# Altium project Node.PrjPCB
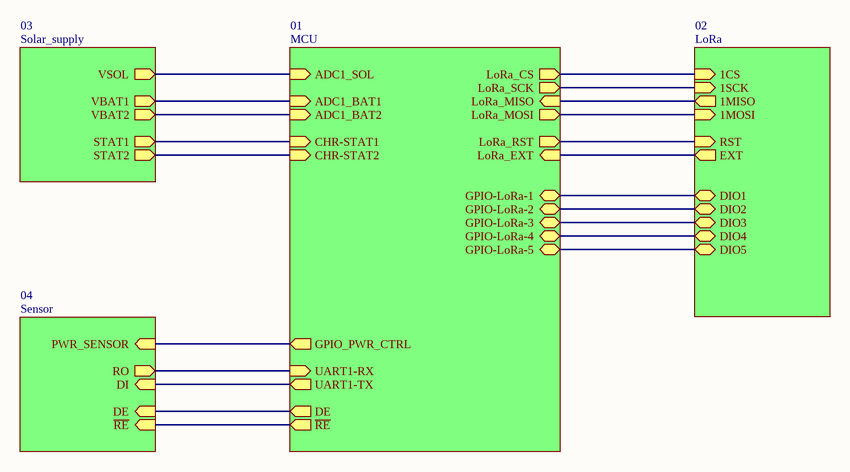
[diagram p0: Main.SchDoc]
5 sheets, 112 parts. Net scope: hierarchical (ports join the sheet entries above them; power ports are global).
Board files: Node.PcbDoc, Node_v2.PcbDoc
Sheets:
  Main.SchDoc
    03 = Solar_supply.SchDoc
    01 = MCU.SchDoc
    02 = LoRa.SchDoc
    04 = Sensor.SchDoc

## Sheet Main.SchDoc: =ProjectName
size A4; CheckedBy: DatNB; Author: Ven; CompanyName: Nacentech; Organization: IMET

### Sub-sheets
01 = MCU: LoRa_MOSI (out), LoRa_MISO (in), ADC1_SOL (in), GPIO-LoRa-3 (bidir), GPIO-LoRa-4 (bidir), CHR-STAT2 (in), CHR-STAT1 (in), DE (out), UART1-TX (out), GPIO-LoRa-1 (bidir), GPIO-LoRa-2 (bidir), ADC1_BAT2 (in), ADC1_BAT1 (in), LoRa_RST (out), LoRa_CS (out), LoRa_EXT (in), GPIO-LoRa-5 (bidir), UART1-RX (in), LoRa_SCK (out), GPIO_PWR_CTRL (out), ~{RE} (out)
02 = LoRa: 1CS (in), 1MOSI (in), EXT (out), 1MISO (out), 1SCK (in), RST (in), DIO4 (bidir), DIO5 (bidir), DIO1 (bidir), DIO3 (bidir), DIO2 (bidir)
03 = Solar_supply: VBAT2 (out), STAT1 (out), VBAT1 (out), VSOL (out), STAT2 (out)
04 = Sensor: ~{RE} (in), RO (out), DI (in), DE (in), PWR_SENSOR (in)

### Nets
NetC5_1: sheet 03/VBAT1, sheet 01/ADC1_BAT1
NetC6_1: sheet 03/VBAT2, sheet 01/ADC1_BAT2
NetC7_1: sheet 03/VSOL, sheet 01/ADC1_SOL
NetIC2_1: sheet 01/UART1-RX, sheet 04/RO
NetIC2_2: sheet 01/~{RE}, sheet 04/~{RE}
NetIC2_3: sheet 01/DE, sheet 04/DE
NetIC2_4: sheet 01/UART1-TX, sheet 04/DI
NetIC4_3: sheet 03/STAT1, sheet 01/CHR-STAT1
NetIC4_5: sheet 03/STAT2, sheet 01/CHR-STAT2
NetR3_1: sheet 01/LoRa_EXT, sheet 02/EXT
NetR12_2: sheet 01/GPIO_PWR_CTRL, sheet 04/PWR_SENSOR
NetU1_4: sheet 01/LoRa_RST, sheet 02/RST
NetU1_6: sheet 01/GPIO-LoRa-1, sheet 02/DIO1
NetU1_7: sheet 01/GPIO-LoRa-2, sheet 02/DIO2
NetU1_8: sheet 01/GPIO-LoRa-3, sheet 02/DIO3
NetU1_10: sheet 01/GPIO-LoRa-4, sheet 02/DIO4
NetU1_11: sheet 01/GPIO-LoRa-5, sheet 02/DIO5
NetU1_12: sheet 01/LoRa_SCK, sheet 02/1SCK
NetU1_13: sheet 01/LoRa_MISO, sheet 02/1MISO
NetU1_14: sheet 01/LoRa_MOSI, sheet 02/1MOSI
NetU1_15: sheet 01/LoRa_CS, sheet 02/1CS

### Notes on the sheet
- Project:
- Page Contents:
- Size:
- Date:
- A4
- Checked by:
- Time:
- Revision:
- Sheet
- of
- File:

## Sheet Solar_supply.SchDoc: =ProjectName
size A4; CheckedBy: DatNB; Author: Ven; CompanyName: Nacentech; Organization: IMET
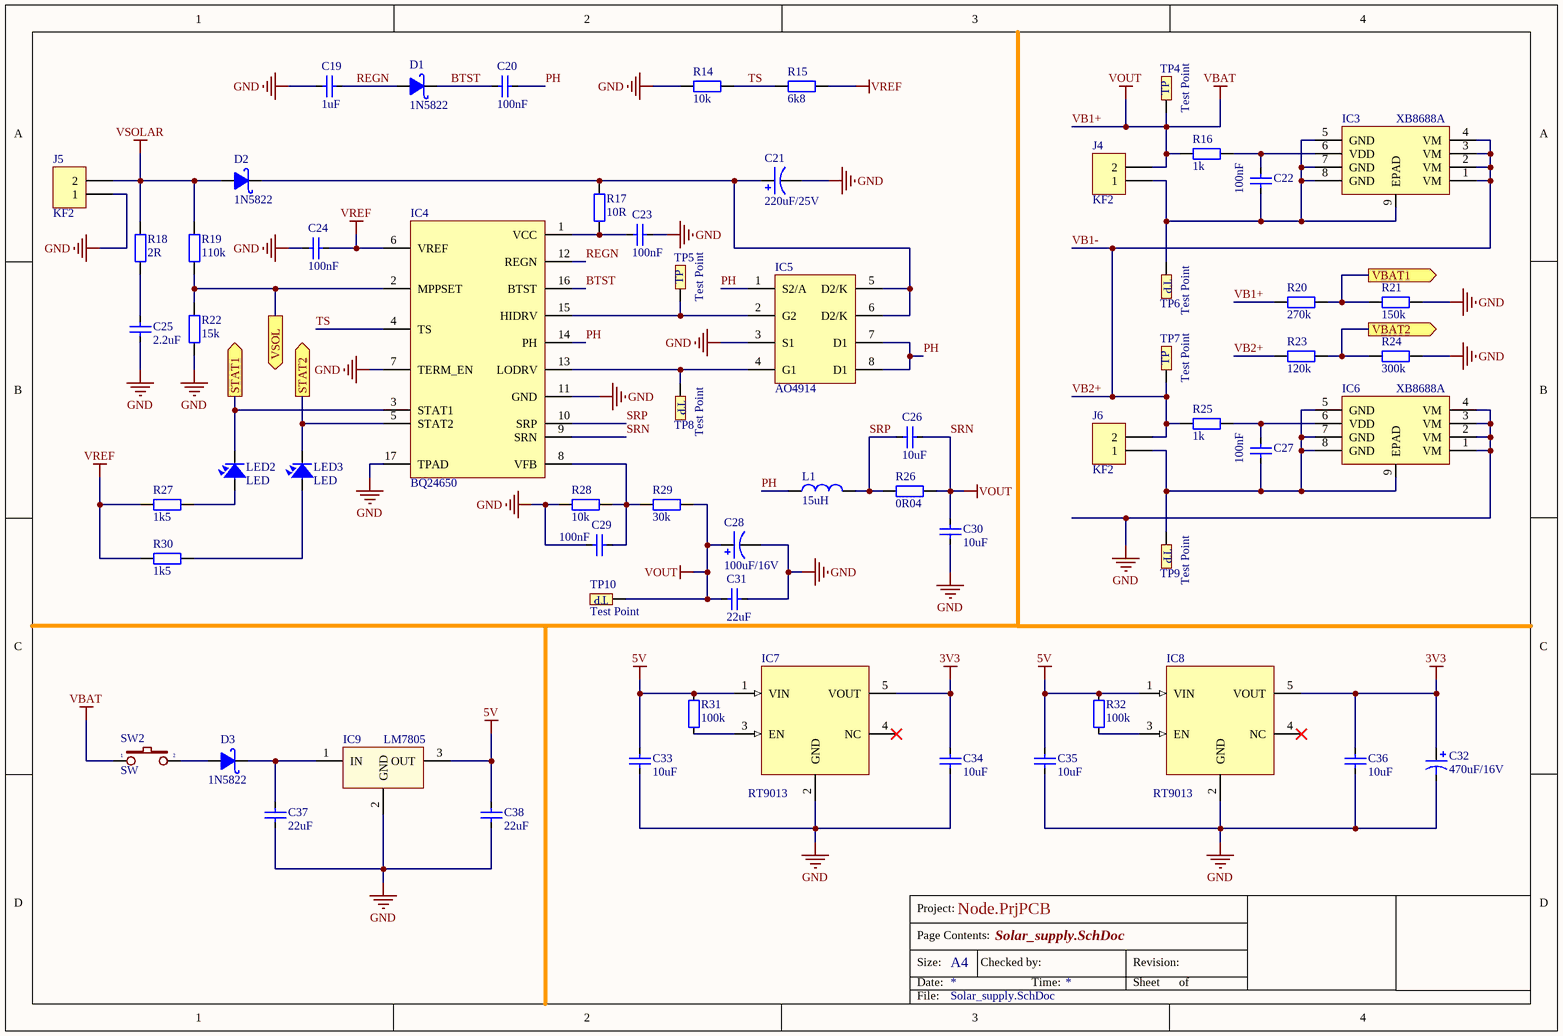
[diagram p1: Solar_supply.SchDoc]

### Parts
C19  1uF  [CAP_0805]
C20  100nF  [CAP_0805]
C21  220uF/25V  [C5mm]
C22  100nF  [CAP_0805]
C23  100nF  [CAP_0805]
C24  100nF  [CAP_0805]
C25  2.2uF  [CAP_0805]
C26  10uF  [CAP_0805]
C27  100nF  [CAP_0805]
C28  100uF/16V  [C5mm]
C29  100nF  [CAP_0805]
C30  10uF  [CAP_0805]
C31  22uF  [CAP_0805]
C32  470uF/16V  [C8mm]
C33  10uF  [CAP_0805]
C34  10uF  [CAP_0805]
C35  10uF  [CAP_0805]
C36  10uF  [CAP_0805]
C37  22uF  [CAP_0805]
C38  22uF  [CAP_0805]
D1  1N5822  [DIO-214AC(SMA)]
D2  1N5822  [DIO-214AC(SMA)]
D3  1N5822  [DIO-214AC(SMA)]
IC3  XB8688A  [SOP8-PP]
IC4  BQ24650  [VQFN-16]
IC5  AO4914  [SOIC-8]
IC6  XB8688A  [SOP8-PP]
IC7  RT9013  [SOT23-5]
IC8  RT9013  [SOT23-5]
IC9  LM7805  [TO-252]
J4  KF2  [KF2-5.08]
J5  KF2  [KF2-5.08]
J6  KF2  [KF2-5.08]
L1  15uH  [L-SMD-M-7.3x4.5]
LED2  LED  [LED-0805-Red]
LED3  LED  [LED-0805-Orange]
R14  10k  [RES-SMD-0805]
R15  6k8  [RES-SMD-0805]
R16  1k  [RES-SMD-0805]
R17  10R  [RES-SMD-0805]
R18  2R  [RES-SMD-0805]
R19  110k  [RES-SMD-0805]
R20  270k  [RES-SMD-0805]
R21  150k  [RES-SMD-0805]
R22  15k  [RES-SMD-0805]
R23  120k  [RES-SMD-0805]
R24  300k  [RES-SMD-0805]
R25  1k  [RES-SMD-0805]
R26  0R04  [RES-SMD-2512]
R27  1k5  [RES-SMD-0805]
R28  10k  [RES-SMD-0805]
R29  30k  [RES-SMD-0805]
R30  1k5  [RES-SMD-0805]
R31  100k  [RES-SMD-0805]
R32  100k  [RES-SMD-0805]
SW2  SW  [SW2]
TP4  Test Point  [TP_SMD]
TP5  Test Point  [TP_SMD]
TP6  Test Point  [TP_SMD]
TP7  Test Point  [TP_SMD]
TP8  Test Point  [TP_SMD]
TP9  Test Point  [TP_SMD]
TP10  Test Point  [TP_SMD]

### Ports
STAT1 (out), STAT2 (out), VBAT1 (out), VBAT2 (out), VSOL (out)

### Nets
3V3: C32.1 C34.2 C36.2 IC7.5(VOUT) IC8.5(VOUT)
5V: C33.2 C35.2 C38.2 IC7.1(VIN) IC8.1(VIN) IC9.3(OUT) R31.1 R32.1
GND: C19.2 C21.2 C23.2 C24.2 C25.1 C28.2 C29.1 C30.1 C31.1 C32.2 C33.1 C34.1 C35.1 C36.1 C37.1 C38.1 IC4.7(TERM_EN) IC4.11(GND) IC4.17(TPAD) IC5.3(S1) IC6.1(VM) IC6.2(VM) IC6.3(VM) IC6.4(VM) IC7.2(GND) IC8.2(GND) IC9.2(GND) J5.1 R14.1 R21.1 R22.2 R24.1 R28.1
SRN: C26.1 C28.1 C30.2 C31.2 IC4.9(SRN) J4.2 R16.2 R20.2 R26.2 R29.1 SW2.1 TP4.1 TP10.1  [also labelled VB1+, VBAT, VOUT]
VREF: C24.1 IC4.6(VREF) R15.2 R27.1 R30.1
VSOLAR: D2.1(A) J5.2 R18.1 R19.2
BTST: C20.1 D1.2(K) IC4.16(BTST)
PH: C20.2 IC4.14(PH) IC5.1(S2/A) IC5.7(D1) IC5.8(D1) L1.1
REGN: C19.1 D1.1(A) IC4.12(REGN)
SRP: C26.2 IC4.10(SRP) L1.2 R26.1
TS: IC4.4(TS) R14.2 R15.1
VB1-: IC3.1(VM) IC3.2(VM) IC3.3(VM) IC3.4(VM) J6.2 R23.2 R25.2 TP7.1  [also labelled VB2+]
NetC5_1: R20.1 R21.2 ; port VBAT1
NetC6_1: R23.1 R24.2 ; port VBAT2
NetC7_1: IC4.2(MPPSET) R19.1 R22.1 ; port VSOL
NetC21_1: C21.1 D2.2(K) IC5.5(D2/K) IC5.6(D2/K) R17.1
NetC22_1: C22.1 IC3.5(GND) IC3.7(GND) IC3.8(GND) IC3.9(EPAD) J4.1 TP6.1
NetC22_2: C22.2 IC3.6(VDD) R16.1
NetC23_1: C23.1 IC4.1(VCC) R17.2
NetC25_2: C25.2 R18.2
NetC27_1: C27.1 IC6.5(GND) IC6.7(GND) IC6.8(GND) IC6.9(EPAD) J6.1 TP9.1
NetC27_2: C27.2 IC6.6(VDD) R25.1
NetC29_2: C29.2 IC4.8(VFB) R28.2 R29.2
NetC37_2: C37.2 D3.2(K) IC9.1(IN)
NetD3_1: D3.1(A) SW2.2
NetIC4_3: IC4.3(STAT1) LED2.2 ; port STAT1
NetIC4_5: IC4.5(STAT2) LED3.2 ; port STAT2
NetIC4_13: IC4.13(LODRV) IC5.4(G1) TP8.1
NetIC4_15: IC4.15(HIDRV) IC5.2(G2) TP5.1
NetIC7_3: IC7.3(EN) R31.2
NetIC8_3: IC8.3(EN) R32.2
NetLED2_1: LED2.1 R27.2
NetLED3_1: LED3.1 R30.2

Not connected (* = marked no-connect by the designer): IC7 4(NC)*; IC8 4(NC)*

### Notes on the sheet
- Project:
- Page Contents:
- Size:
- Date:
- A4
- Checked by:
- Time:
- Revision:
- Sheet
- of
- File:

### Library data of the parts
C19 C20 C22-C27 C29-C31 C33-C38 = CapSMD: Capacitor; Value: 33p; Published: 8-Jun-2000; LatestRevisionDate: 17-Jul-2002; LatestRevisionNote: Re-released for DXP Platform.; PackageReference: RAD-0.3; Publisher: Altium Limited
C21 C28 C32 = Cap Pol: Polarized Capacitor (Axial); Published: 8-Jun-2000; LatestRevisionDate: 17-Jul-2002; LatestRevisionNote: Re-released for DXP Platform.; PackageReference: POLAR0.8; Publisher: Altium Limited
D1-D3 = 1N5822: Schottky Rectifiers; Value: Diode c?m 1N5408
IC3 IC6 = XB8688: One Cell Lithium-ion/Polymer Battery Protection IC
IC4 = BQ24650: BQ24650 Stand-Alone Synchronous Buck Battery Charge Controller for Solar Power / With Maximum Power Point Tracking
IC5 = AO4914: Dual N-Channel Enhancement Mode Field Effect Transistor with Schottky Diode
IC7 IC8 = RT9013: RT9013-33GB IC REG LINEAR 3.3V 500mA SOT23-5
IC9 = LM78xx: LDO to 5V; Value: LM7805
J4-J6 = KF2: Manufacturer: Würth Elektronik eiSos GmbH; partNo: 691103110002; ComponentLink1 Description: Manufacturer; ComponentLink2 Description: Datasheet; NoPins: 2; Created Date: 29 October 2013; ComponentLink1URL: http://www.we-online.com; ComponentLink2URL: http://katalog.we-online.de/em/datasheet/6911031100xx.pdf; Created by: Karrer Zheng
L1 = Inductor: Value: 150 mH
LED2 LED3 = LED: LED Single colour Green and Red; Value: LED 3 ly Single Colour
R14-R30 = Resistor - SMD: Resistor SMD; Manufacturer: Generic Components; Class: Passive; Published: 08/06/2000; Publisher: Altium Hobart Technology Centre
R31 R32 = Resistor - SMD: Resistor; Manufacturer: Generic Components; Class: Passive; Published: 08/06/2000; Publisher: Altium Hobart Technology Centre
SW2 = SW2: Switch button 2 pin; Value: SW chip 2 pin
TP4-TP10 = TP: CONNECT 1

## Sheet MCU.SchDoc: =ProjectName
size A4; CheckedBy: DatNB; Author: Ven; CompanyName: Nacentech; Organization: IMET
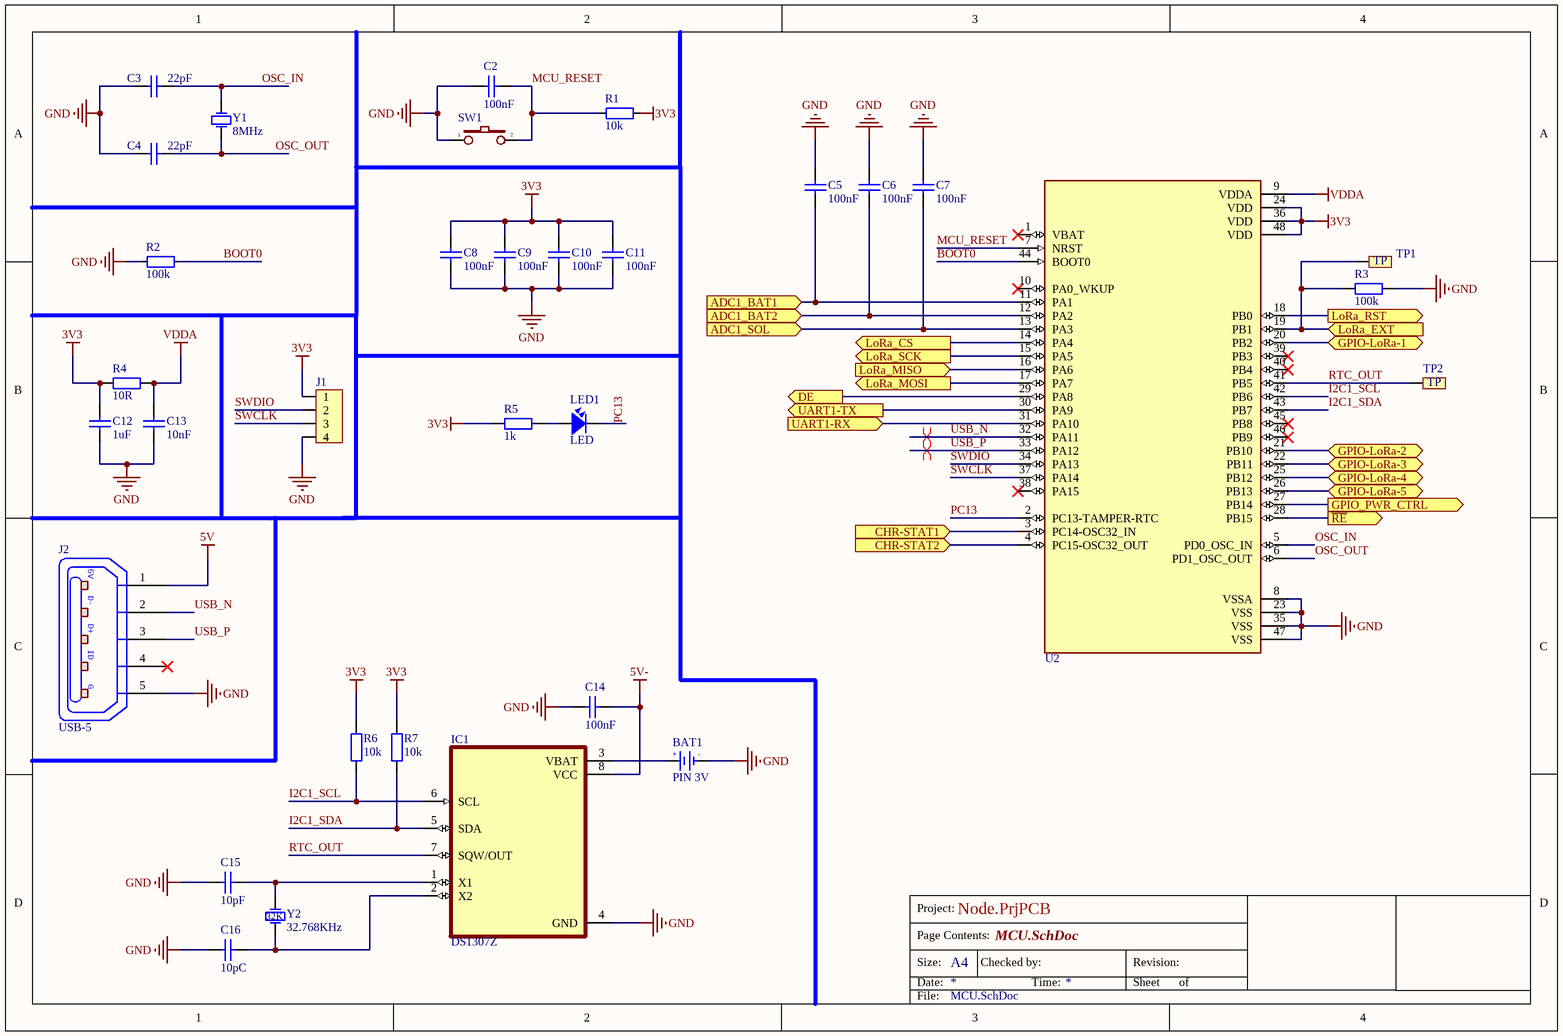
[diagram p2: MCU.SchDoc]

### Parts
BAT1  PIN 3V  [CR1220 SMD]
C2  100nF  [CAP_0805]
C3  22pF  [CAP_0805]
C4  22pF  [CAP_0805]
C5  100nF  [CAP_0805]
C6  100nF  [CAP_0805]
C7  100nF  [CAP_0805]
C8  100nF  [CAP_0805]
C9  100nF  [CAP_0805]
C10  100nF  [CAP_0805]
C11  100nF  [CAP_0805]
C12  1uF  [CAP_0805]
C13  10nF  [CAP_0805]
C14  100nF  [CAP_0805]
C15  10pF  [CAP_0805]
C16  10pC  [CAP_0805]
IC1  DS1307Z  [SOIC-8]
J1  ST_Link  [Jump_4p]  (value not drawn)
J2  USB-5  [USB-M1]
LED1  LED  [LED-0805-Red]
R1  10k  [RES-SMD-0805]
R2  100k  [RES-SMD-0805]
R3  100k  [RES-SMD-0805]
R4  10R  [RES-SMD-0805]
R5  1k  [RES-SMD-0805]
R6  10k  [RES-SMD-0805]
R7  10k  [RES-SMD-0805]
SW1  SW  [SW 3x2x4]  (value not drawn)
TP1  Test Point  [TP_SMD]  (value not drawn)
TP2  Test Point  [TP_SMD]  (value not drawn)
U2  STM32  [LQFP 48]  (value not drawn)
Y1  8MHz  [XTAL]
Y2  32.768KHz  [XTAL32K]

### Ports
ADC1_BAT1 (in), ADC1_BAT2 (in), ADC1_SOL (in), CHR-STAT1 (in), CHR-STAT2 (in), DE (out), GPIO-LoRa-1 (bidir), GPIO-LoRa-2 (bidir), GPIO-LoRa-3 (bidir), GPIO-LoRa-4 (bidir), GPIO-LoRa-5 (bidir), GPIO_PWR_CTRL (out), LoRa_CS (out), LoRa_EXT (in), LoRa_MISO (in), LoRa_MOSI (out), LoRa_RST (out), LoRa_SCK (out), UART1-RX (in), UART1-TX (out), ~{RE} (out)

### Nets
3V3: C8.2 C9.2 C10.2 C11.2 C12.2 J1.1 R1.1 R4.1 R5.1 R6.2 R7.2 U2.24(VDD) U2.36(VDD) U2.48(VDD)
5V: J2.1(P1)
5V-: C14.2 IC1.8(VCC)
GND: BAT1.2(GND) C2.1 C3.1 C4.1 C5.2 C6.2 C7.2 C8.1 C9.1 C10.1 C11.1 C12.1 C13.1 C14.1 C15.2 C16.2 IC1.4(GND) J1.4 J2.5(P5) R2.2 R3.2 SW1.1 U2.8(VSSA) U2.23(VSS) U2.35(VSS) U2.47(VSS)
VDDA: C13.2 R4.2 U2.9(VDDA)
BOOT0: R2.1 U2.44(BOOT0)
I2C1_SCL: IC1.6(SCL) R6.1 U2.42(PB6)
I2C1_SDA: IC1.5(SDA) R7.1 U2.43(PB7)
MCU_RESET: C2.2 R1.2 SW1.2 U2.7(NRST)
OSC_IN: C3.2 U2.5(PD0_OSC_IN) Y1.1(OSC1)
OSC_OUT: C4.2 U2.6(PD1_OSC_OUT) Y1.2(OSC2)
PC13: LED1.2 U2.2(PC13-TAMPER-RTC)
RTC_OUT: IC1.7(SQW/OUT) TP2.1 U2.41(PB5)
SWCLK: J1.3 U2.37(PA14)
SWDIO: J1.2 U2.34(PA13)
USB_N: J2.2(P2) U2.32(PA11)
USB_P: J2.3(P3) U2.33(PA12)
NetBAT1_1: BAT1.1(+3V) IC1.3(VBAT)
NetC5_1: C5.1 U2.11(PA1) ; port ADC1_BAT1
NetC6_1: C6.1 U2.12(PA2) ; port ADC1_BAT2
NetC7_1: C7.1 U2.13(PA3) ; port ADC1_SOL
NetC15_1: C15.1 IC1.1(X1) Y2.1(OSC1)
NetC16_1: C16.1 IC1.2(X2) Y2.2(OSC2)
NetIC2_1: U2.31(PA10) ; port UART1-RX
NetIC2_2: U2.28(PB15) ; port ~{RE}
NetIC2_3: U2.29(PA8) ; port DE
NetIC2_4: U2.30(PA9) ; port UART1-TX
NetIC4_3: U2.3(PC14-OSC32_IN) ; port CHR-STAT1
NetIC4_5: U2.4(PC15-OSC32_OUT) ; port CHR-STAT2
NetLED1_1: LED1.1 R5.2
NetR3_1: R3.1 TP1.1 U2.19(PB1) ; port LoRa_EXT
NetR12_2: U2.27(PB14) ; port GPIO_PWR_CTRL
NetU1_4: U2.18(PB0) ; port LoRa_RST
NetU1_6: U2.20(PB2) ; port GPIO-LoRa-1
NetU1_7: U2.21(PB10) ; port GPIO-LoRa-2
NetU1_8: U2.22(PB11) ; port GPIO-LoRa-3
NetU1_10: U2.25(PB12) ; port GPIO-LoRa-4
NetU1_11: U2.26(PB13) ; port GPIO-LoRa-5
NetU1_12: U2.15(PA5) ; port LoRa_SCK
NetU1_13: U2.16(PA6) ; port LoRa_MISO
NetU1_14: U2.17(PA7) ; port LoRa_MOSI
NetU1_15: U2.14(PA4) ; port LoRa_CS

Not connected (* = marked no-connect by the designer): J2 4(P4)*; U2 1(VBAT)* 10(PA0_WKUP)* 38(PA15)* 39(PB3)* 40(PB4)* 45(PB8)* 46(PB9)*

### Layout directives
differential pair: USB_N, USB_P

### Notes on the sheet
- Project:
- Page Contents:
- Size:
- Date:
- A4
- Checked by:
- Time:
- Revision:
- Sheet
- of
- File:
- (in symbol PIN 3V) +; -
- (in symbol USB-5) 5V; D-; D+; ID; G
- (in symbol XTAL/32KHz) 32K

### Library data of the parts
BAT1 = PIN 3V: Battery 3VDC; Value: PIN 3V
C2-C16 = CapSMD: Capacitor; Value: 33p; Published: 8-Jun-2000; LatestRevisionDate: 17-Jul-2002; LatestRevisionNote: Re-released for DXP Platform.; PackageReference: RAD-0.3; Publisher: Altium Limited
J1 = Header4: Header IDC, 4 x 1 Pin Vertical 2.54mm Pitch (Non-Boxed, Male); Manufacturer: W¨¹rth Elektronik eiSos GmbH; partNo: 613002143121; ComponentLink1 Description: Manufacturer; ComponentLink2 Description: Datasheet; NoPins: 02; Created Date: 29 March 2013; ComponentLink1URL: http://www.we-online.com; ComponentLink2URL: http://katalog.we-online.de/em/datasheet/6130xx143121.pdf; Created by: Karrer Zheng
J2 = USB-5: Manufacturer: FCI; Manufacturer Part Number: 10118193-0001LF; Connector Type: USB - micro B; Number of Contacts: 5; Gender: Receptacle; Specifications: USB 2.0; .Creator: MM; .Checked PCB: RF; Supplier 1: Digi-Key; RoHS: RoHS Compliant; Category: Connectors, Interconnects; Stock 1: 28642; Pricing 1: 1=0.46, 10=0.433, 25=0.3712, 50=0.3156, 100=0.3032, 250=0.27224, 500=0.25988 (USD); Packaging: Cut Tape (CT); Mounting Type: Surface Mount, Right Angle, Horizontal; Features: Shielded, Solder Retention; Ingress Protection: -; ComponentLink1URL: http://portal.fciconnect.com/Comergent//fci/drawing/10118193.pdf; ComponentLink1Description: http://portal.fciconnect.com/Comergent//fci/drawing/10118193.pdf; Supplier Part Number 1: 609-4616-1-ND; .Checked SCH: MM
LED1 = LED: as LED2 on sheet Solar_supply
R1 R2 = Resistor - SMD: as R31 on sheet Solar_supply; Published: 08/06/2000; Publisher: Altium Hobart Technology Centre
R3-R7 = Resistor - SMD: as R14 on sheet Solar_supply; Published: 08/06/2000; Publisher: Altium Hobart Technology Centre
SW1 = SW2: as SW2 on sheet Solar_supply
TP1 TP2 = TP: CONNECT 1
U2 = STM32F103C8T6: STM32 ARM-based 32-bit MCU with 64 Kbytes Flash, 64-pin LQFP, Industrial Temperature
Y1 = XTAL: Crystal Oscillator; Published: 8-Jun-2000; LatestRevisionDate: 17-Jul-2002; LatestRevisionNote: Re-released for DXP Platform.; PackageReference: R38; Publisher: Altium Limited
Y2 = XTAL/32KHz: Crystal Oscillator; Published: 8-Jun-2000; LatestRevisionDate: 17-Jul-2002; LatestRevisionNote: Re-released for DXP Platform.; PackageReference: R38; Publisher: Altium Limited

## Sheet LoRa.SchDoc: =ProjectName
size A4; CheckedBy: DatNB; Author: Ven; CompanyName: Nacentech; Organization: IMET
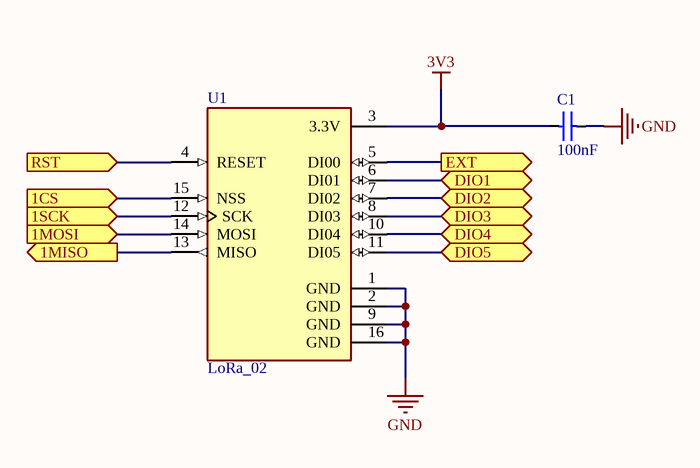
[diagram p3: LoRa.SchDoc]

### Parts
C1  100nF  [CAP_0805]
U1  LoRa_02  [Ra-02]

### Ports
1CS (in), 1MISO (out), 1MOSI (in), 1SCK (in), DIO1 (bidir), DIO2 (bidir), DIO3 (bidir), DIO4 (bidir), DIO5 (bidir), EXT (out), RST (in)

### Nets
3V3: C1.1 U1.3(3.3V)
GND: C1.2 U1.1(GND) U1.2(GND) U1.9(GND) U1.16(GND)
NetR3_1: U1.5(DI00) ; port EXT
NetU1_4: U1.4(RESET) ; port RST
NetU1_6: U1.6(DI01) ; port DIO1
NetU1_7: U1.7(DI02) ; port DIO2
NetU1_8: U1.8(DI03) ; port DIO3
NetU1_10: U1.10(DI04) ; port DIO4
NetU1_11: U1.11(DI05) ; port DIO5
NetU1_12: U1.12(SCK) ; port 1SCK
NetU1_13: U1.13(MISO) ; port 1MISO
NetU1_14: U1.14(MOSI) ; port 1MOSI
NetU1_15: U1.15(NSS) ; port 1CS

### Notes on the sheet
- Project:
- Page Contents:
- Size:
- Date:
- A4
- Checked by:
- Time:
- Revision:
- Sheet
- of
- File:

### Library data of the parts
C1 = CapSMD: Capacitor; Value: 33p; Published: 8-Jun-2000; LatestRevisionDate: 17-Jul-2002; LatestRevisionNote: Re-released for DXP Platform.; PackageReference: RAD-0.3; Publisher: Altium Limited

## Sheet Sensor.SchDoc: =ProjectName
size A4; CheckedBy: DatNB; Author: Ven; CompanyName: Nacentech; Organization: IMET
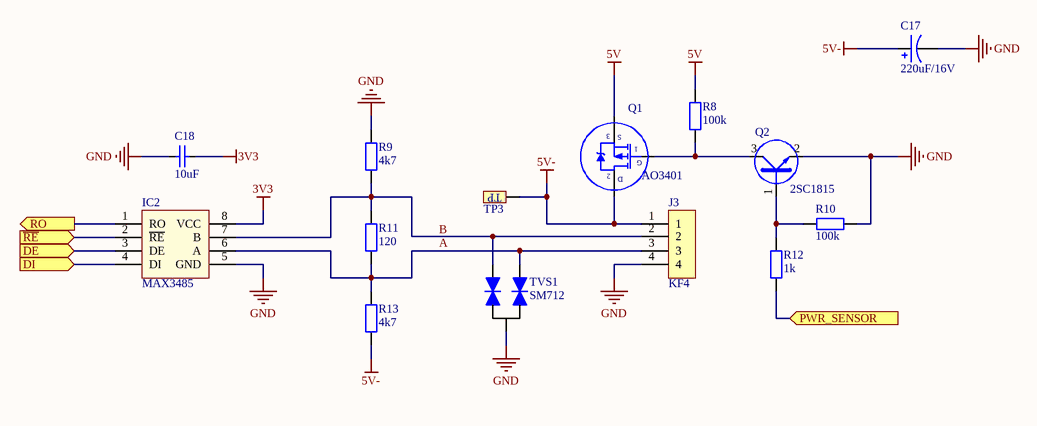
[diagram p4: Sensor.SchDoc]

### Parts
C17  220uF/16V  [C5mm]
C18  10uF  [CAP_0805]
IC2  MAX3485  [SO-8]
J3  KF4  [KF4-5.08]
Q1  AO3401  [SOT23A]
Q2  2SC1815  [SOT23D]
R8  100k  [RES-SMD-0805]
R9  4k7  [RES-SMD-0805]
R10  100k  [RES-SMD-0805]
R11  120  [RES-SMD-0805]
R12  1k  [RES-SMD-0805]
R13  4k7  [RES-SMD-0805]
TP3  Test Point  [TP_SMD]  (value not drawn)
TVS1  SM712  [SOT23]

### Ports
DE (in), DI (in), PWR_SENSOR (in), RO (out), ~{RE} (in)

### Nets
3V3: C18.2 IC2.8(VCC)
5V: Q1.3(S) R8.1
5V-: C17.1 J3.1 Q1.2(D) R13.1 TP3.1
GND: C17.2 C18.1 IC2.5(GND) J3.4 Q2.2(E) R9.2 R10.2 TVS1.3(K)
A: IC2.6(A) J3.3 R11.1 R13.2 TVS1.1(A)
NetIC2_1: IC2.1(RO) ; port RO
NetIC2_2: IC2.2(~{RE}) ; port ~{RE}
NetIC2_3: IC2.3(DE) ; port DE
NetIC2_4: IC2.4(DI) ; port DI
NetIC2_7: IC2.7(B) J3.2 R9.1 R11.2 TVS1.2(A)
NetQ1_1: Q1.1(G) Q2.3(C) R8.2
NetQ2_1: Q2.1(B) R10.1 R12.1
NetR12_2: R12.2 ; port PWR_SENSOR

### Notes on the sheet
- Labels drawn without touching a wire or pin: B
- Project:
- Page Contents:
- Size:
- Date:
- A4
- Checked by:
- Time:
- Revision:
- Sheet
- of
- File:

### Library data of the parts
C17 = Cap Pol: Polarized Capacitor (Axial); Published: 8-Jun-2000; LatestRevisionDate: 17-Jul-2002; LatestRevisionNote: Re-released for DXP Platform.; PackageReference: POLAR0.8; Publisher: Altium Limited
C18 = CapSMD: Capacitor; Value: 33p; Published: 8-Jun-2000; LatestRevisionDate: 17-Jul-2002; LatestRevisionNote: Re-released for DXP Platform.; PackageReference: RAD-0.3; Publisher: Altium Limited
IC2 = MAX485: RS232 - RS485 (Same sn75176)
J3 = KF4: Manufacturer: W¨¹rth Elektronik eiSos GmbH; PartNo: 691133710004; ComponentLink1 Description: Manufacturer; ComponentLink2 Description: Datasheet; NoPins: 4; ComponentLink1 URL: http://www.we-online.com; ComponentLink2 URL: http://katalog.we-online.de/em/datasheet/6911337100xx.pdf; Created By: Baojun Chen; Created Date: 4-Aug-15
Q1 = MOSFET_P: 30V 5.8A P-Channel MOSFET
Q2 = C1815: NPN 600mW, ECB; Value: C1815
R8-R13 = Resistor - SMD: as R14 on sheet Solar_supply; Published: 08/06/2000; Publisher: Altium Hobart Technology Centre
TP3 = TP: CONNECT 1
TVS1 = BAV70: Value: 1N4148

## Nets that join several sheets
3V3: Solar_supply (5 pins), MCU (14 pins), LoRa (C1.1 U1.3), Sensor (C18.2 IC2.8)
5V: Solar_supply (8 pins), MCU (J2.1), Sensor (Q1.3 R8.1)
5V-: MCU (C14.2 IC1.8), Sensor (5 pins)
GND: Solar_supply (33 pins), MCU (26 pins), LoRa (5 pins), Sensor (8 pins)
NetC5_1: Solar_supply (R20.1 R21.2), MCU (C5.1 U2.11)
NetC6_1: Solar_supply (R23.1 R24.2), MCU (C6.1 U2.12)
NetC7_1: Solar_supply (IC4.2 R19.1 R22.1), MCU (C7.1 U2.13)
NetIC2_1: MCU (U2.31), Sensor (IC2.1)
NetIC2_2: MCU (U2.28), Sensor (IC2.2)
NetIC2_3: MCU (U2.29), Sensor (IC2.3)
NetIC2_4: MCU (U2.30), Sensor (IC2.4)
NetIC4_3: Solar_supply (IC4.3 LED2.2), MCU (U2.3)
NetIC4_5: Solar_supply (IC4.5 LED3.2), MCU (U2.4)
NetR3_1: MCU (R3.1 TP1.1 U2.19), LoRa (U1.5)
NetR12_2: MCU (U2.27), Sensor (R12.2)
NetU1_4: MCU (U2.18), LoRa (U1.4)
NetU1_6: MCU (U2.20), LoRa (U1.6)
NetU1_7: MCU (U2.21), LoRa (U1.7)
NetU1_8: MCU (U2.22), LoRa (U1.8)
NetU1_10: MCU (U2.25), LoRa (U1.10)
NetU1_11: MCU (U2.26), LoRa (U1.11)
NetU1_12: MCU (U2.15), LoRa (U1.12)
NetU1_13: MCU (U2.16), LoRa (U1.13)
NetU1_14: MCU (U2.17), LoRa (U1.14)
NetU1_15: MCU (U2.14), LoRa (U1.15)